# EAGLE schematic board (EAGLE 7.3.0)
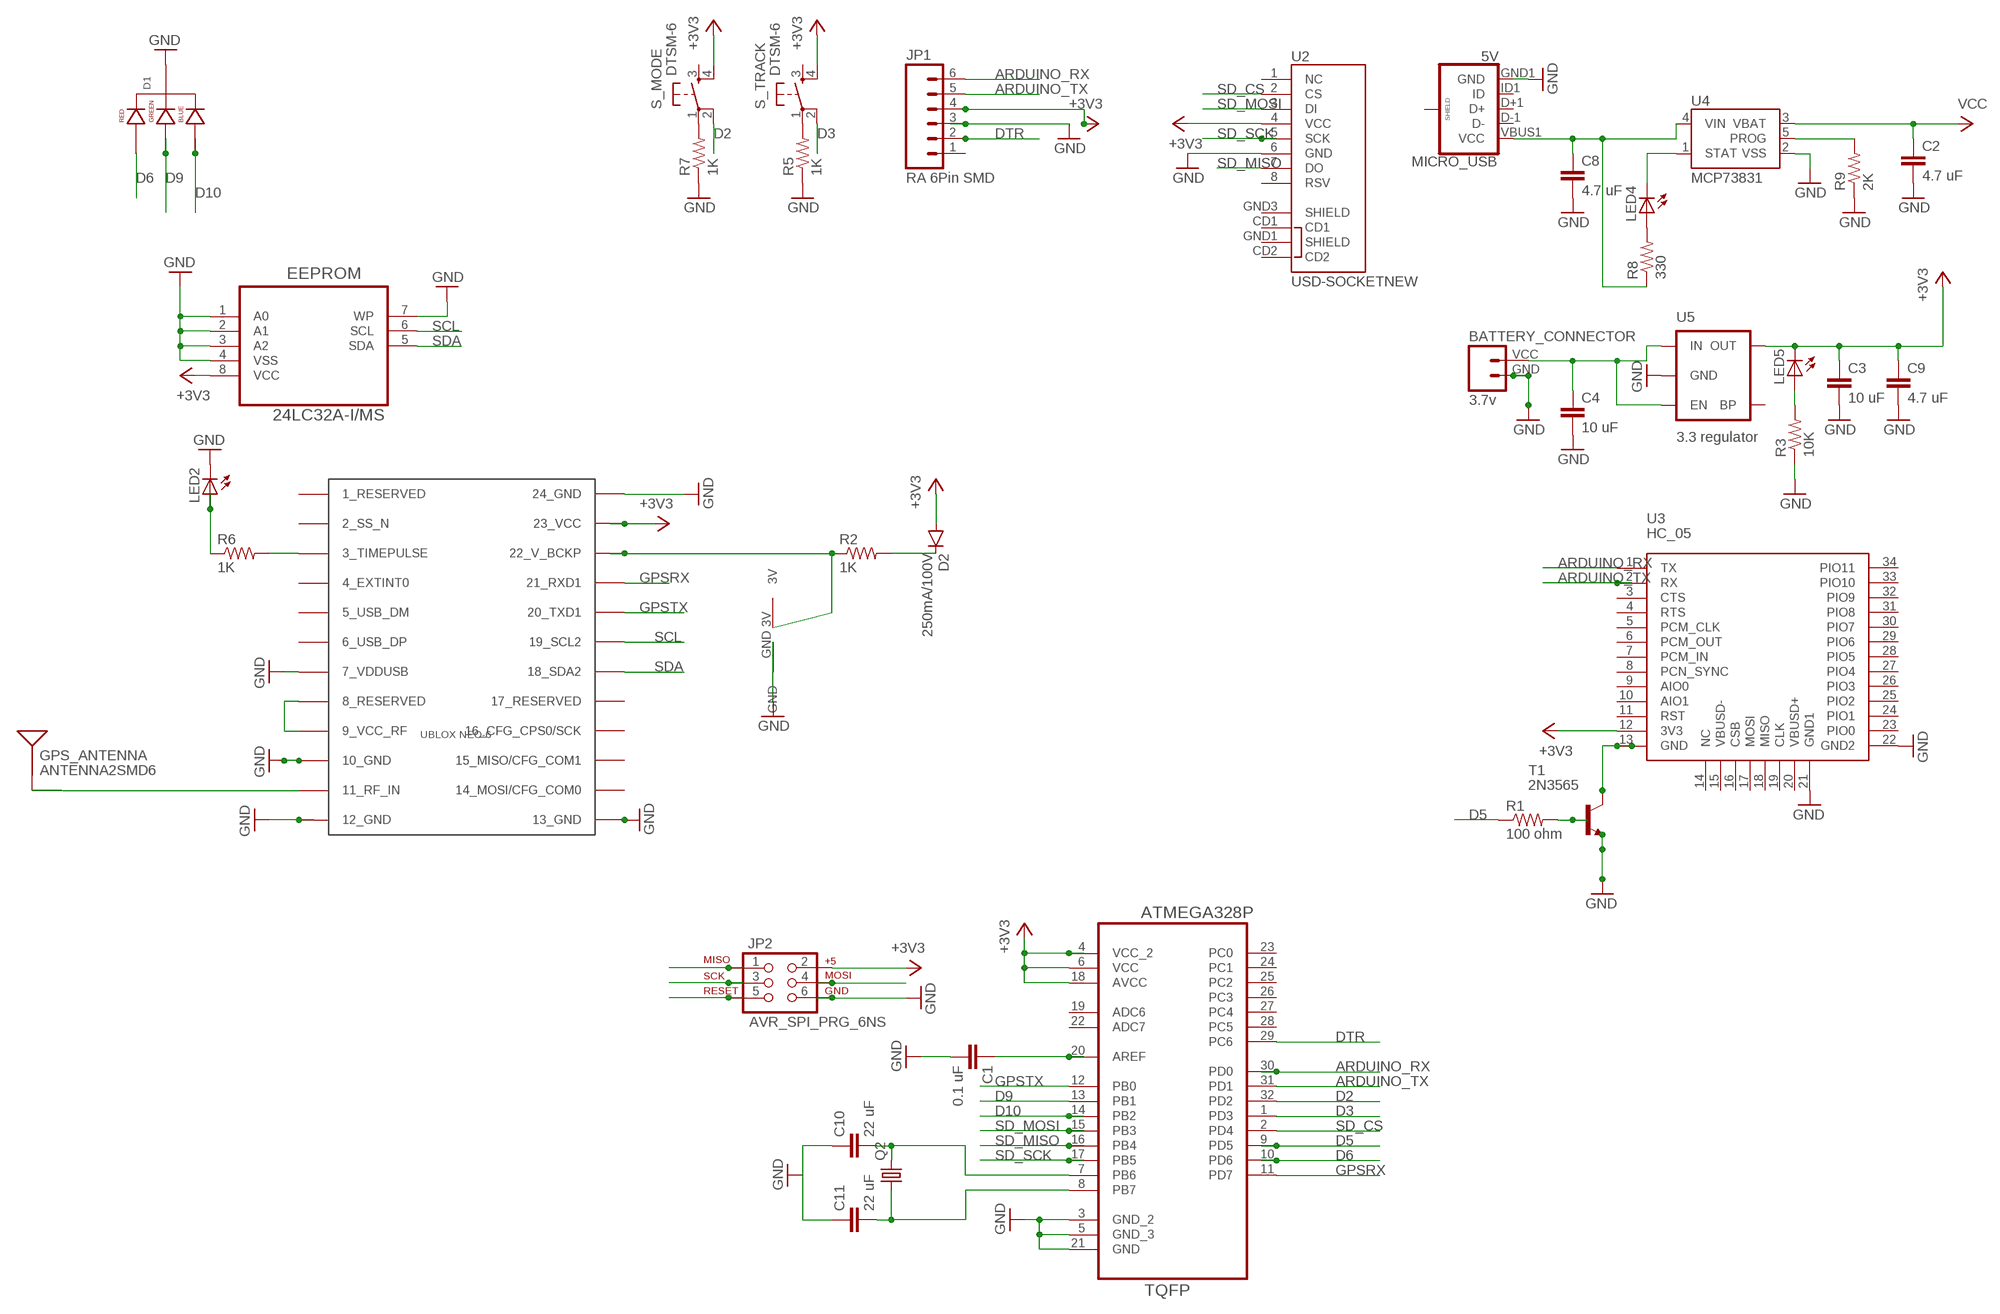
[diagram p0: schematic, sheet 1]

## Parts
BATTERY_CONNECTOR  3.7v  M024UCON-15767  [JST-2-SMD-VERT]
C1  0.1 uF  CAP1206  [1206]
C2  4.7 uF  CAP1206  [1206]
C3  10 uF  CAP1206  [1206]
C4  10 uF  CAP1206  [1206]
C8  4.7 uF  CAP1206  [1206]
C9  4.7 uF  CAP1206  [1206]
C10  22 uF  CAP1206  [1206]
C11  22 uF  CAP1206  [1206]
D1  LED-RGB-CC-THRUCLEAR  [LED-RGB-THRU]
D2  250mA/100V  DIODEBAS16  [SOD-323]
EEPROM  24LC32A-I/MS  [SOP65P490X110-8N]
GPS_ANTENNA  ANTENNA2SMD6  [ANTENNA-CHIP6]
JP1  RA 6Pin SMD  M06SMD  [1X06-SMD]
JP2  AVR_SPI_PRG_6NS  [2X3-NS]
LED2  LED_E  [LED_1206]
LED4  LED_E  [LED_1206]
LED5  LED_E  [LED_1206]
MICRO_USB  5V  USB_MICROB_PLUGCONN-11752  [USB-B-MICRO-SMD_V03]
Q2  CRYSTALCTS406  [CTS406]
R1  100 ohm  RESISTOR1206  [1206]
R2  1K  RESISTOR1206  [1206]
R3  10K  RESISTOR1206  [1206]
R5  1K  RESISTOR1206  [1206]
R6  1K  RESISTOR1206  [1206]
R7  1K  RESISTOR1206  [1206]
R8  330  RESISTOR1206  [1206]
R9  2K  RESISTOR1206  [1206]
S_MODE  DTSM-6  [DTSM-6]
S_TRACK  DTSM-6  [DTSM-6]
T1  2N3565  [TO92]
U2  USD-SOCKETNEW  [MICRO-SD-SOCKET-PP]
U3  HC_05  [BLUETOOTH_SMD]
U4  MCP73831  [SOT23-5]
U5  3.3 regulator  MIC52053.3V  [SOT23-5]
U6  ATMEGA328P-AU  [QFP80P900X900X120-32N]
U$1  UBLOX_NEO-6  [UBLOX_NEO-6P]
U$4  VL1220/HFN  VL1220  [VL1220]

## Nets
+3V3: C3.1 C9.1 D2.A EEPROM.8(VCC) JP1.4 JP2.2 LED5.C S_MODE.4 S_TRACK.4 U2.4(VCC) U3.12(3V3) U5.5(OUT) U6.4(VCC_2) U6.6(VCC) U6.18(AVCC) U$1.23_VCC
ARDUINO_RX: JP1.6 U3.1(TX) U6.30(PD0)
ARDUINO_TX: JP1.5 U3.2(RX) U6.31(PD1)
D2: S_MODE.2 U6.32(PD2)
D3: S_TRACK.2 U6.1(PD3)
D5: R1.1 U6.9(PD5)
D6: D1.1(RED_CATHODE) U6.10(PD6)
D9: D1.3(GREEN_CATHODE) U6.13(PB1)
D10: D1.4(BLUE_CATHODE) U6.14(PB2)
DTR: JP1.2 JP2.5 U6.29(PC6)
GND: BATTERY_CONNECTOR.GND C1.2 C2.2 C3.2 C4.2 C8.2 C9.2 C10.1 C11.1 D1.2(CATHODE) EEPROM.1(A0) EEPROM.2(A1) EEPROM.3(A2) EEPROM.4(VSS) EEPROM.7(WP) JP1.3 JP2.6 LED2.C MICRO_USB.GND1(GND) R3.1 R5.1 R7.1 R9.1 T1.3(E) U2.6(GND) U3.21(GND1) U3.22(GND2) U4.2(VSS) U5.2(GND) U6.3(GND_2) U6.5(GND_3) U6.21(GND) U$1.7_VDDUSB U$1.10_GND U$1.12_GND U$1.13_GND U$1.24_GND U$4.GND
GPSRX: U6.11(PD7) U$1.21_RXD1
GPSTX: U6.12(PB0) U$1.20_TXD1
N$1: D2.C R2.2
N$2: C8.1 MICRO_USB.VBUS1(VCC) R8.1 U4.4(VIN)
N$3: R6.2 U$1.3_TIMEPULSE
N$4: LED2.A R6.1
N$5: U$1.8_RESERVED U$1.9_VCC_RF
N$6: R2.1 U$1.22_V_BCKP U$4.3V
N$7: GPS_ANTENNA.1(SIGNAL) U$1.11_RF_IN
N$8: LED4.A R8.2
N$9: R7.2 S_MODE.1
N$10: R5.2 S_TRACK.1
N$11: LED4.C U4.1(STAT)
N$12: BATTERY_CONNECTOR.VCC C4.1 U5.1(IN) U5.3(EN)
N$15: R9.2 U4.5(PROG)
N$16: LED5.A R3.2
N$19: R1.2 T1.2(B)
N$20: T1.1(C) U3.13(GND)
N$22: C1.1 U6.20(AREF)
N$27: C11.2 Q2.1 U6.8(PB7)
N$29: C10.2 Q2.3 U6.7(PB6)
SCL: EEPROM.6(SCL) U$1.19_SCL2
SD_CS: U2.2(CS) U6.2(PD4)
SD_MISO: JP2.1 U2.7(DO) U6.16(PB4)
SD_MOSI: JP2.4 U2.3(DI) U6.15(PB3)
SD_SCK: JP2.3 U2.5(SCK) U6.17(PB5)
SDA: EEPROM.5(SDA) U$1.18_SDA2
VCC: C2.1 U4.3(VBAT)
Unconnected: JP1.1 MICRO_USB.D+1(D+) MICRO_USB.D-1(D-) MICRO_USB.ID1(ID) MICRO_USB.SHIELD1(SHIELD) MICRO_USB.SHIELD2(SHIELD) MICRO_USB.SHIELD3(SHIELD) S_MODE.3 S_TRACK.3 U2.1(NC) U2.8(RSV) U2.CD1 U2.CD2 U2.GND1(SHIELD) U2.GND3(SHIELD) U3.3(CTS) U3.4(RTS) U3.5(PCM_CLK) U3.6(PCM_OUT) U3.7(PCM_IN) U3.8(PCN_SYNC) U3.9(AIO0) U3.10(AIO1) U3.11(RST) U3.14(NC) U3.15(VBUSD-) U3.16(CSB) U3.17(MOSI) U3.18(MISO) U3.19(CLK) U3.20(VBUSD+) U3.23(PIO0) U3.24(PIO1) U3.25(PIO2) U3.26(PIO3) U3.27(PIO4) U3.28(PIO5) U3.29(PIO6) U3.30(PIO7) U3.31(PIO8) U3.32(PIO9) U3.33(PIO10) U3.34(PIO11) U5.4(BP) U6.19(ADC6) U6.22(ADC7) U6.23(PC0) U6.24(PC1) U6.25(PC2) U6.26(PC3) U6.27(PC4) U6.28(PC5) U$1.1_RESERVED U$1.2_SS_N U$1.4_EXTINT0 U$1.5_USB_DM U$1.6_USB_DP U$1.14_MOSI/CFG_COM0 U$1.15_MISO/CFG_COM1 U$1.16_CFG_CPS0/SCK U$1.17_RESERVED

## Library data of the parts
BATTERY_CONNECTOR = SparkFun-Connectors:M02: Standard 2-pin 0.1" header. Use with - straight break away headers ( PRT-00116) - right angle break away headers (PRT-00553) - swiss pins (PRT-00743) - machine pins (PRT-00117) - female headers (PRT-00115) Molex polarized connector foot print use with: PRT-08233 with associated crimp pins and housings. 2.54_SCREWTERM for use with PRT-10571. 3.5mm Screw Terminal footprints for PRT-08084 5mm Screw Terminal footprints for use with PRT-08432
C1-C4 C8-C11 = SparkFun-Capacitors:CAP: Capacitor Standard 0603 ceramic capacitor, and 0.1" leaded capacitor.
D1 = SparkFun-LED:LED-RGB-CC-THRU: RGB Through-hole common cathode LED SparkFun Storefront: COM-00105 (Clear) COM-09264 (Diffuse); PROD_ID: DIO-08418
D2 = SparkFun-DiscreteSemi:DIODE: Diode These are standard reverse protection diodes and small signal diodes. SMA package can handle up to about 1A. SOD-323 can handle about 200mA. What the SOD-323 package when ordering, there are some mfgs out there that are 5-pin packages.; PROD_ID: DIO-09646
EEPROM = Microchip_By_element14_Batch_1:24LC32A-I/MS: IC, EEPROM, 32KBIT, SERIAL 400KHZ; MPN: 24LC32A-I/MS; OC_FARNELL: 1331330; OC_NEWARK: 69K7672; PACKAGE: 8MSOP; SUPPLIER: Microchip
GPS_ANTENNA = SparkFun-RF:ANTENNA2: Chip antenna Single endded antenna. Common with smaller chip antennas. CHIP4 package is the GPS Chip Antenna SKU: GPS-08418. CHIP5 package is 2.4GHz chip antenna SKU: WRL-00144.
JP1 = SparkFun-Connectors:M06: Header 6 Standard 6-pin 0.1" header. Use with straight break away headers (SKU : PRT-00116), right angle break away headers (PRT-00553), swiss pins (PRT-00743), machine pins (PRT-00117), and female headers (PRT-00115). Molex polarized connector foot print use with SKU : PRT-08094 with associated crimp pins and housings. NOTES ON THE VARIANTS LOCK and LOCK_LONGPADS... This footprint was designed to help hold the alignment of a through-hole component (i.e. 6-pin header) while soldering it into place. You may notice that each hole has been shifted either up or down by 0.005 of an inch from it's more standard position (which is a perfectly straight line). This slight alteration caused the pins (the squares in the middle) to touch the edges of the holes. Because they are alternating, it causes a "brace" to hold the component in place. 0.005 has proven to be the perfect amount of "off-center" position when using our standard breakaway headers. Although looks a little odd when you look at the bare footprint, once you have a header in there, the alteration is very hard to notice. Also,if you push a header all the way into place, it is covered up entirely on the bottom side. This idea of altering the position of holes to aid alignment will be further integrated into the Sparkfun Library for other footprints. It can help hold any component with 3 or more connection pins.; PROD_ID: CONN-08971
JP2 = SparkFun-Connectors:AVR_SPI_PRG_6: AVR ISP 6 Pin This is the reduced ISP connector for AVR programming. Common on Arduino. This footprint will take up less PCB space and can be used with a 10-pin to 6-pin adapter such as SKU: BOB-08508 **Special note about "TEST_POINT" package. The stop mask is on the top side, so if you want your programming test points to be on the bottom of your board, make sure to place this package on the bottom side of the board. This also ensure that the orientation to program from the bottom side will be correct.
LED2 LED4 LED5 = eagle-ltspice:LED_E: LED Source: http://www.osram.convergy.de Source: www.luxeon.com Source: www.kingbright.com; SPICEMODEL: NONE; SPICEPREFIX: D; SPICETYPE: diode
MICRO_USB = SparkFun-Connectors:USB_MICROB_PLUG: USB Micro-B connectors Some male, some female. Watch your step!; PROD_ID: CONN-11752
Q2 = crystal:CRYSTAL: CRYSTAL; OC_FARNELL: unknown; OC_NEWARK: unknown
R1-R3 R5-R9 = SparkFun-Passives:RESISTOR: Resistor Basic schematic elements and footprints for 0603, 1206, and PTH resistors.
S_MODE S_TRACK = switch-tact:DTSM-6; OC_FARNELL: unknown
T1 = transistor:2N3565: NPN TRANSISTOR
U2 = SparkFun-Connectors:USD-SOCKET: microSD Socket Push-push type uSD socket. Schematic element and footprint production proven. Spark Fun Electronics SKU : PRT-00127. tDoc lines correctly indicate media card edge positions when inserting (unlocked, locked, depressed). NOTE: CD1 and CD2 are connected internally; PROD_ID: CONN-07820
U3 = SerialPortBluetooth:HC_05
U4 = SparkFun-PowerIC:MCP73831: Miniature single cell, fully integrated Li-Ion, Li-polymer charge management controller http://ww1.microchip.com/downloads/en/DeviceDoc/20001984g.pdf IC-09995; PROD_ID: IC-09995
U5 = SparkFun-PowerIC:MIC5205: MIC5205 150mA vreg 3.3V - VREG-00822 5V - VREG-00823; PROD_ID: VREG-00822
U6 = Ava:ATMEGA328P-AU; DESCRIPTION: 8-bit Microcontroller with In-System Programmable Flash; MPN: ATMEGA328P-AU; OC_FARNELL: 1715486; OC_NEWARK: 14R4631; PACKAGE: TQFP-32; SUPPLIER: Atmel
U$1 = Ava:UBLOX_NEO-6: UBLOX NEO-6 GPS MODULE Author Anthony Stirk / http://ava.upuaut.net http://www.u-blox.com/images/downloads/Product_Docs/LEA-6_NEO-6_MAX_HardwareIntegrationManual_%28GPS.G6-HW-09007%29.pdf http://www.u-blox.com/images/downloads/Product_Docs/NEO-6_DataSheet_%28GPS.G6-HW-09005%29.pdf
U$4 = footie:VL1220